# Altium schematic sheet div_Ele.SchDoc: SysP17_Team10: div. Elektronik
size A4; CheckedBy: U. Hauser; Author: N. Dürr / M. Mettler; CompanyName: NTB; Organization: NTB Interstate University of Applied; Address1: Werdenbergstrasse 4; Address3: 9471 Buchs; Address4: Switzerland; SheetNumber: 3; SheetTotal: 5; Organization1: Sciences of Technology Buchs; Size: A4; ShortDescription: Schema von einzelnen Schaltungen
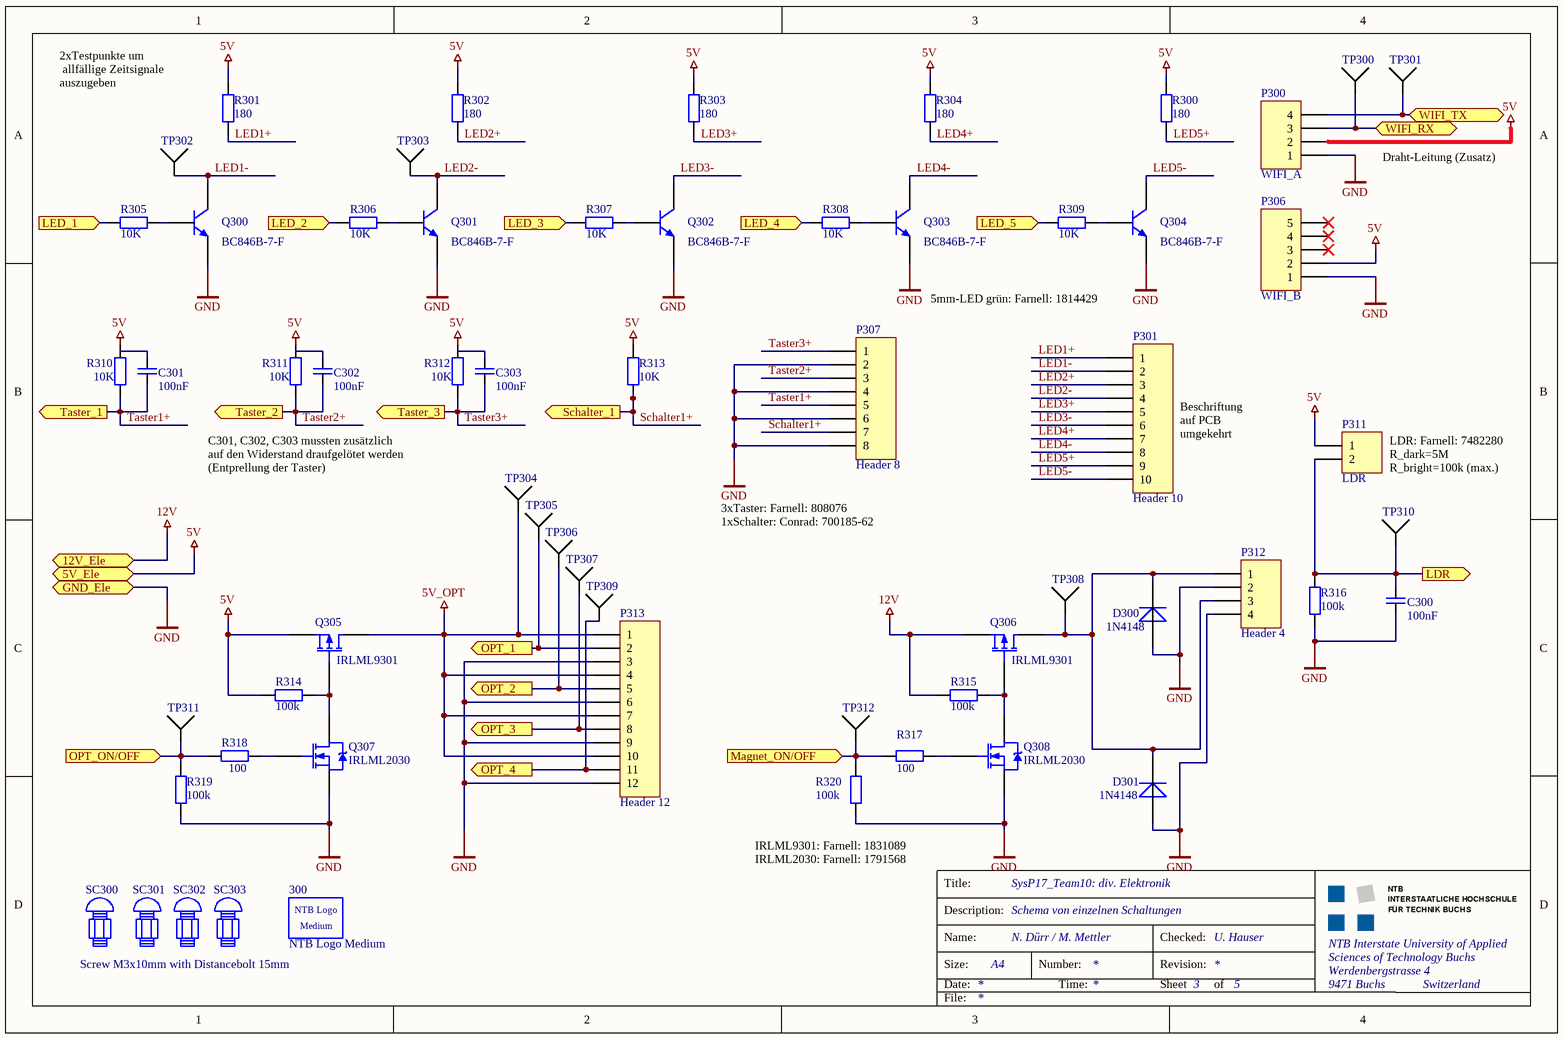
[diagram p0: div_Ele.SchDoc]

## Parts
300  NTB Logo Medium  [NTB Logo Medium]
C300  100nF  [CAPC0805]
C301  100nF  [CAPC0805]
C302  100nF  [CAPC0805]
C303  100nF  [CAPC0805]
D300  1N4148  [SMD_2Pin_Diode]
D301  1N4148  [SMD_2Pin_Diode]
P300  WIFI_A  [HDR1X4]
P301  Header 10  [HDR1X10]
P306  WIFI_B  [HDR1X5]
P307  Header 8  [HDR1X8]
P311  LDR  [2Pin Header 2.54mm]
P312  Header 4  [HDR1X4]
P313  Header 12  [HDR1X12]
Q300  BC846B-7-F  [DIODS_SOT23_1B2E3C_3_H]
Q301  BC846B-7-F  [DIODS_SOT23_1B2E3C_3_H]
Q302  BC846B-7-F  [DIODS_SOT23_1B2E3C_3_H]
Q303  BC846B-7-F  [DIODS_SOT23_1B2E3C_3_H]
Q304  BC846B-7-F  [DIODS_SOT23_1B2E3C_3_H]
Q305  IRLML9301  [SOT23_L]
Q306  IRLML9301  [SOT23_L]
Q307  IRLML2030  [SOT23_L]
Q308  IRLML2030  [SOT23_L]
R300  value 180  [GEN_R0805_H]  (hidden comment: Generic)
R301  value 180  [GEN_R0805_H]  (hidden comment: Generic)
R302  value 180  [GEN_R0805_H]  (hidden comment: Generic)
R303  value 180  [GEN_R0805_H]  (hidden comment: Generic)
R304  value 180  [GEN_R0805_H]  (hidden comment: Generic)
R305  value 10K  [GEN_R0805_H]  (hidden comment: Generic)
R306  value 10K  [GEN_R0805_H]  (hidden comment: Generic)
R307  value 10K  [GEN_R0805_H]  (hidden comment: Generic)
R308  value 10K  [GEN_R0805_H]  (hidden comment: Generic)
R309  value 10K  [GEN_R0805_H]  (hidden comment: Generic)
R310  value 10K  [GEN_R0805_H]  (hidden comment: Generic)
R311  value 10K  [GEN_R0805_H]  (hidden comment: Generic)
R312  value 10K  [GEN_R0805_H]  (hidden comment: Generic)
R313  value 10K  [GEN_R0805_H]  (hidden comment: Generic)
R314  value 100k  [GEN_R0805_H]  (hidden comment: Generic)
R315  value 100k  [GEN_R0805_H]  (hidden comment: Generic)
R316  value 100k  [GEN_R0805_H]  (hidden comment: Generic)
R317  value 100  [GEN_R0805_H]  (hidden comment: Generic)
R318  value 100  [GEN_R0805_H]  (hidden comment: Generic)
R319  value 100k  [GEN_R0805_H]  (hidden comment: Generic)
R320  value 100k  [GEN_R0805_H]  (hidden comment: Generic)
SC300  Screw M3x10mm with Distancebolt 15mm  [Screw_M3x10_Dist_15mm]  (value not drawn)
SC301  Screw M3x10mm with Distancebolt 15mm  [Screw_M3x10_Dist_15mm]  (value not drawn)
SC302  Screw M3x10mm with Distancebolt 15mm  [Screw_M3x10_Dist_15mm]
SC303  Screw M3x10mm with Distancebolt 15mm  [Screw_M3x10_Dist_15mm]  (value not drawn)
TP300  Testpunkt 1mm  [GEN_TP-THT-1.1mm_1_H]  (value not drawn)
TP301  Testpunkt 1mm  [GEN_TP-THT-1.1mm_1_H]  (value not drawn)
TP302  Testpunkt 1mm  [GEN_TP-THT-1.1mm_1_H]  (value not drawn)
TP303  Testpunkt 1mm  [GEN_TP-THT-1.1mm_1_H]  (value not drawn)
TP304  Testpunkt 1mm  [GEN_TP-THT-1.1mm_1_H]  (value not drawn)
TP305  Testpunkt 1mm  [GEN_TP-THT-1.1mm_1_H]  (value not drawn)
TP306  Testpunkt 1mm  [GEN_TP-THT-1.1mm_1_H]  (value not drawn)
TP307  Testpunkt 1mm  [GEN_TP-THT-1.1mm_1_H]  (value not drawn)
TP308  Testpunkt 1mm  [GEN_TP-THT-1.1mm_1_H]  (value not drawn)
TP309  Testpunkt 1mm  [GEN_TP-THT-1.1mm_1_H]  (value not drawn)
TP310  Testpunkt 1mm  [GEN_TP-THT-1.1mm_1_H]  (value not drawn)
TP311  Testpunkt 1mm  [GEN_TP-THT-1.1mm_1_H]  (value not drawn)
TP312  Testpunkt 1mm  [GEN_TP-THT-1.1mm_1_H]  (value not drawn)

## Ports
5V_Ele, 12V_Ele, GND_Ele, LDR (out), LED_1 (in), LED_2 (in), LED_3 (in), LED_4 (in), LED_5 (in), Magnet_ON/OFF (in), OPT_1 (out), OPT_2 (out), OPT_3 (out), OPT_4 (out), OPT_ON/OFF (in), Schalter_1 (out), Taster_1 (out), Taster_2 (out), Taster_3 (out), WIFI_RX (bidir), WIFI_TX (bidir)

## Nets
5V: P300.2 P306.2 P311.1 Q305.2(S) R300.1 R301.1 R302.1 R303.1 R304.1 R310.1 R311.1 R312.1 R313.1 R314.2 ; port 5V_Ele
5V_OPT: P313.1 P313.4 P313.7 P313.10 Q305.1(D) TP304.1
12V: Q306.2(S) R315.2 ; port 12V_Ele
GND: C300.2 D300.2(A) D301.2(A) P300.1 P306.1 P307.2 P307.4 P307.6 P307.8 P312.2 P312.4 P313.3 P313.6 P313.9 P313.12 Q300.2(E) Q301.2(E) Q302.2(E) Q303.2(E) Q304.2(E) Q307.2(S) Q308.2(S) R316.2 R319.1 R320.1 ; port GND_Ele
LDR: C300.1 P311.2 R316.1 TP310.1 ; port LDR
LED1+: P301.1 R301.2
LED1-: P301.2 Q300.3(C) TP302.1
LED2+: P301.3 R302.2
LED2-: P301.4 Q301.3(C) TP303.1
LED3+: P301.5 R303.2
LED3-: P301.6 Q302.3(C)
LED4+: P301.7 R304.2
LED4-: P301.8 Q303.3(C)
LED5+: P301.9 R300.2
LED5-: P301.10 Q304.3(C)
LED_1: R305.1 ; port LED_1
LED_2: R306.1 ; port LED_2
LED_3: R307.1 ; port LED_3
LED_4: R308.1 ; port LED_4
LED_5: R309.1 ; port LED_5
Magnet_ON/OFF: R317.2 R320.2 TP312.1 ; port Magnet_ON/OFF
OPT_1: P313.2 TP305.1 ; port OPT_1
OPT_2: P313.5 TP306.1 ; port OPT_2
OPT_3: P313.8 TP307.1 ; port OPT_3
OPT_4: P313.11 TP309.1 ; port OPT_4
OPT_ON/OFF: R318.2 R319.2 TP311.1 ; port OPT_ON/OFF
Schalter1+: P307.7 R313.2 ; port Schalter_1
Taster1+: C301.2 P307.5 R310.2 ; port Taster_1
Taster2+: C302.2 P307.3 R311.2 ; port Taster_2
Taster3+: C303.2 P307.1 R312.2 ; port Taster_3
WIFI_RX: P300.3 TP300.1 ; port WIFI_RX
WIFI_TX: P300.4 TP301.1 ; port WIFI_TX
NetD300_1: D300.1(K) D301.1(K) P312.1 P312.3 Q306.1(D) TP308.1
NetQ300_1: Q300.1(B) R305.2
NetQ301_1: Q301.1(B) R306.2
NetQ302_1: Q302.1(B) R307.2
NetQ303_1: Q303.1(B) R308.2
NetQ304_1: Q304.1(B) R309.2
NetQ305_3: Q305.3(G) Q307.1(D) R314.1
NetQ306_3: Q306.3(G) Q308.1(D) R315.1
NetQ307_3: Q307.3(G) R318.1
NetQ308_3: Q308.3(G) R317.1

Not connected (* = marked no-connect by the designer): C301 1; C302 1; C303 1; P306 3* 4* 5*

## Notes on the sheet
- 2xTestpunkte um
  allfällige Zeitsignale
  auszugeben
- Draht-Leitung (Zusatz)
- 5mm-LED grün: Farnell: 1814429
- (near P301) Beschriftung auf PCB umgekehrt
- C301, C302, C303 mussten zusätzlich
  auf den Widerstand draufgelötet werden
  (Entprellung der Taster)
- LDR: Farnell: 7482280
  R_dark=5M
  R_bright=100k (max.)
- 3xTaster: Farnell: 808076
  1xSchalter: Conrad: 700185-62
- (near R320) IRLML9301: Farnell: 1831089
  IRLML2030: Farnell: 1791568
- Title:
- Description:
- Size:
- Date:
- Name:
- Number:
- Time:
- Revision:
- Sheet
- Checked:
- of
- File:
- (in symbol NTB Logo Medium) NTB Logo; Medium

## Library data of the parts
C300-C303 = C Bipolar 0805: X7R MLCC 0805 (2012 Metric); Rated Voltage: 50V; Value: 100n; Tolerance: 10%; Case-EIA: 0805; Case-Metric: 2012; Temperature Characteristics EIA: X7R; Temperature Range EIA: -55C/+125C
D300 D301 = 1N4148: High Conductance Fast Diode; #Manufacturer: Generic Components; #Publisher: Dr. A. Heinzelmann; #Class: Discrete; #ClassSub: Diode - Switching; #Published: 2006-10-31; ComponentLink1Description: Datasheet; ComponentLink1URL: https://www.distrelec.com/distrelec/datasheets.nsf/WebAttachments/13CA773B80E18E83C125722E0045A8DA/$File/Diotec_Silizium-Dioden_bedrahtet_1N_4148_-_1N_4448_-_1N_4150..._Datasheet_DE_EN.pdf; ComponentLink2Description: Distributor; ComponentLink2URL: https://www.distrelec.ch/ishopWebFront/catalog/product.do/para/node/is/acaaaaaaaaaa/and/highlightNode/is/603016/and/id/is/01/and/series/is/1.html; Value: 1N4148
P300 P312 = Header 4: Header, 4-Pin; LatestRevisionDate: 17-Jul-2002; LatestRevisionNote: Re-released for DXP Platform.; Publisher: Altium Limited
P301 = Header 10: Header, 10-Pin; LatestRevisionDate: 17-Jul-2002; LatestRevisionNote: Re-released for DXP Platform.; Publisher: Altium Limited
P306 = Header 5: Header, 5-Pin; LatestRevisionDate: 17-Jul-2002; LatestRevisionNote: Re-released for DXP Platform.; Publisher: Altium Limited
P307 = Header 8: Header, 8-Pin; LatestRevisionDate: 17-Jul-2002; LatestRevisionNote: Re-released for DXP Platform.; Publisher: Altium Limited
P311 = Header 2: Header, 2-Pin; LatestRevisionDate: 17-Jul-2002; LatestRevisionNote: Re-released for DXP Platform.; Publisher: Altium Limited
P313 = Header 12: Header, 12-Pin; LatestRevisionDate: 17-Jul-2002; LatestRevisionNote: Re-released for DXP Platform.; Publisher: Altium Limited
Q300-Q304 = DIODS_BC846B-7-F_SOT23: NPN General-purpose Transistor; Manufacturer: DIODES INC; #Class: SEMICONDUCTOR-TRANSISTOR; #ClassSub: BJT-NPN; Published: 17-Sep-2003; Publisher: Altium Limited; ComponentLink1Description: Manufacturer Link; ComponentLink1URL: http://www.diodes.com/products/catalog/detail.php?item-id=6689&popup=datasheet; ComponentLink2Description: Datasheet; ComponentLink2URL: http://www.diodes.com/datasheets/ds11108.pdf; ComponentLink3Description: Packaging Specification; ComponentLink3URL: http://www.diodes.com/datasheets/ap02001.pdf; Distributor: Farnell; RefFootprint: DIODS_SOT23_1B2E3C_3_H; Manufacturer PartNr: BC846B-7-F; Distributor PartNr: 1773617; Status: nLager; RefFileFOO: *; RefFileSCH: *; RefSchema: DIODS_BC846B-7-F_SOT23
Q305 Q306 = MOSFET-P: P-Channel MOSFET; Published: 8-Jun-2000; LatestRevisionDate: 17-Jul-2002; LatestRevisionNote: Re-released for DXP Platform.; PackageVersion: 1995/1996; PackageReference: E3; Publisher: Altium Limited; PackageDescription: TO, Flat Index; 3 In-Line, Axial Leads; Body Dia. 4.6mm; Lead Dia. 0.5 mm (max)
Q307 Q308 = NMOS-2: N-Channel Power MOSFET; Note: Pin 2 is electrically connected to pin 4.; Published: 8-Jun-2000; LatestRevisionDate: 17-Jul-2002; LatestRevisionNote: Re-released for DXP Platform.; DatasheetVersion: PD-9.814; PackageVersion: Feb-1997; PackageReference: TO-220AB; Publisher: Altium Limited; PackageDescription: TO, Thru-Hole, Vertical, Heatsink Mounted; 3 In-Line Leads; Pitch 2.54 mm; ComponentLink1Description: Manufacturer Link; ComponentLink1URL: http://www.irf.com/
R300-R320 = GEN_R_2: generic resistor; Manufacturer: Tbd; #Class: PASSIVE; Published: 8-Jun-2000; Publisher: Altium Limited; #ClassSub: RESISTOR; ComponentLink1Description: Manufacturer Link; ComponentLink2Description: Datasheet; ComponentLink3Description: Packaging Specification; Distributor: tbd; RefFootprint: GEN_R0805_H; Manufacturer PartNr: tbd; Distributor PartNr: tbd; RefFileFOO: *; RefFileSCH: *; RefSchema: GEN_R_2
SC300-SC303 = Screw M3 10mm with Distancebolt 15mm
TP300-TP312 = Testpunkt 1mm: Manufacturer: Keystone Electronics; #Class: Connector; #ClassSub: Laborbuchse; Publisher: B.Sc. Ursella; Published: 2008-12-16; Supplier 1: Mouser; Supplier Part Number 1: 534-1035; Status: nLager; FootprintRef: GEN_TP-THT-1.1mm_1_H; RefFootprint: GEN_TP-THT-1.1mm_1_H; RefFileFOO: *; RefFileSCH: *; RefSchema: Testpunkt 1mm